# EAGLE design feather-v1 (EAGLE 9.4.0)
COMPANY: ADAFRUIT INDUSTRIES; DRAWN: KTOWN; REV: B

## Sheet 1 of 2
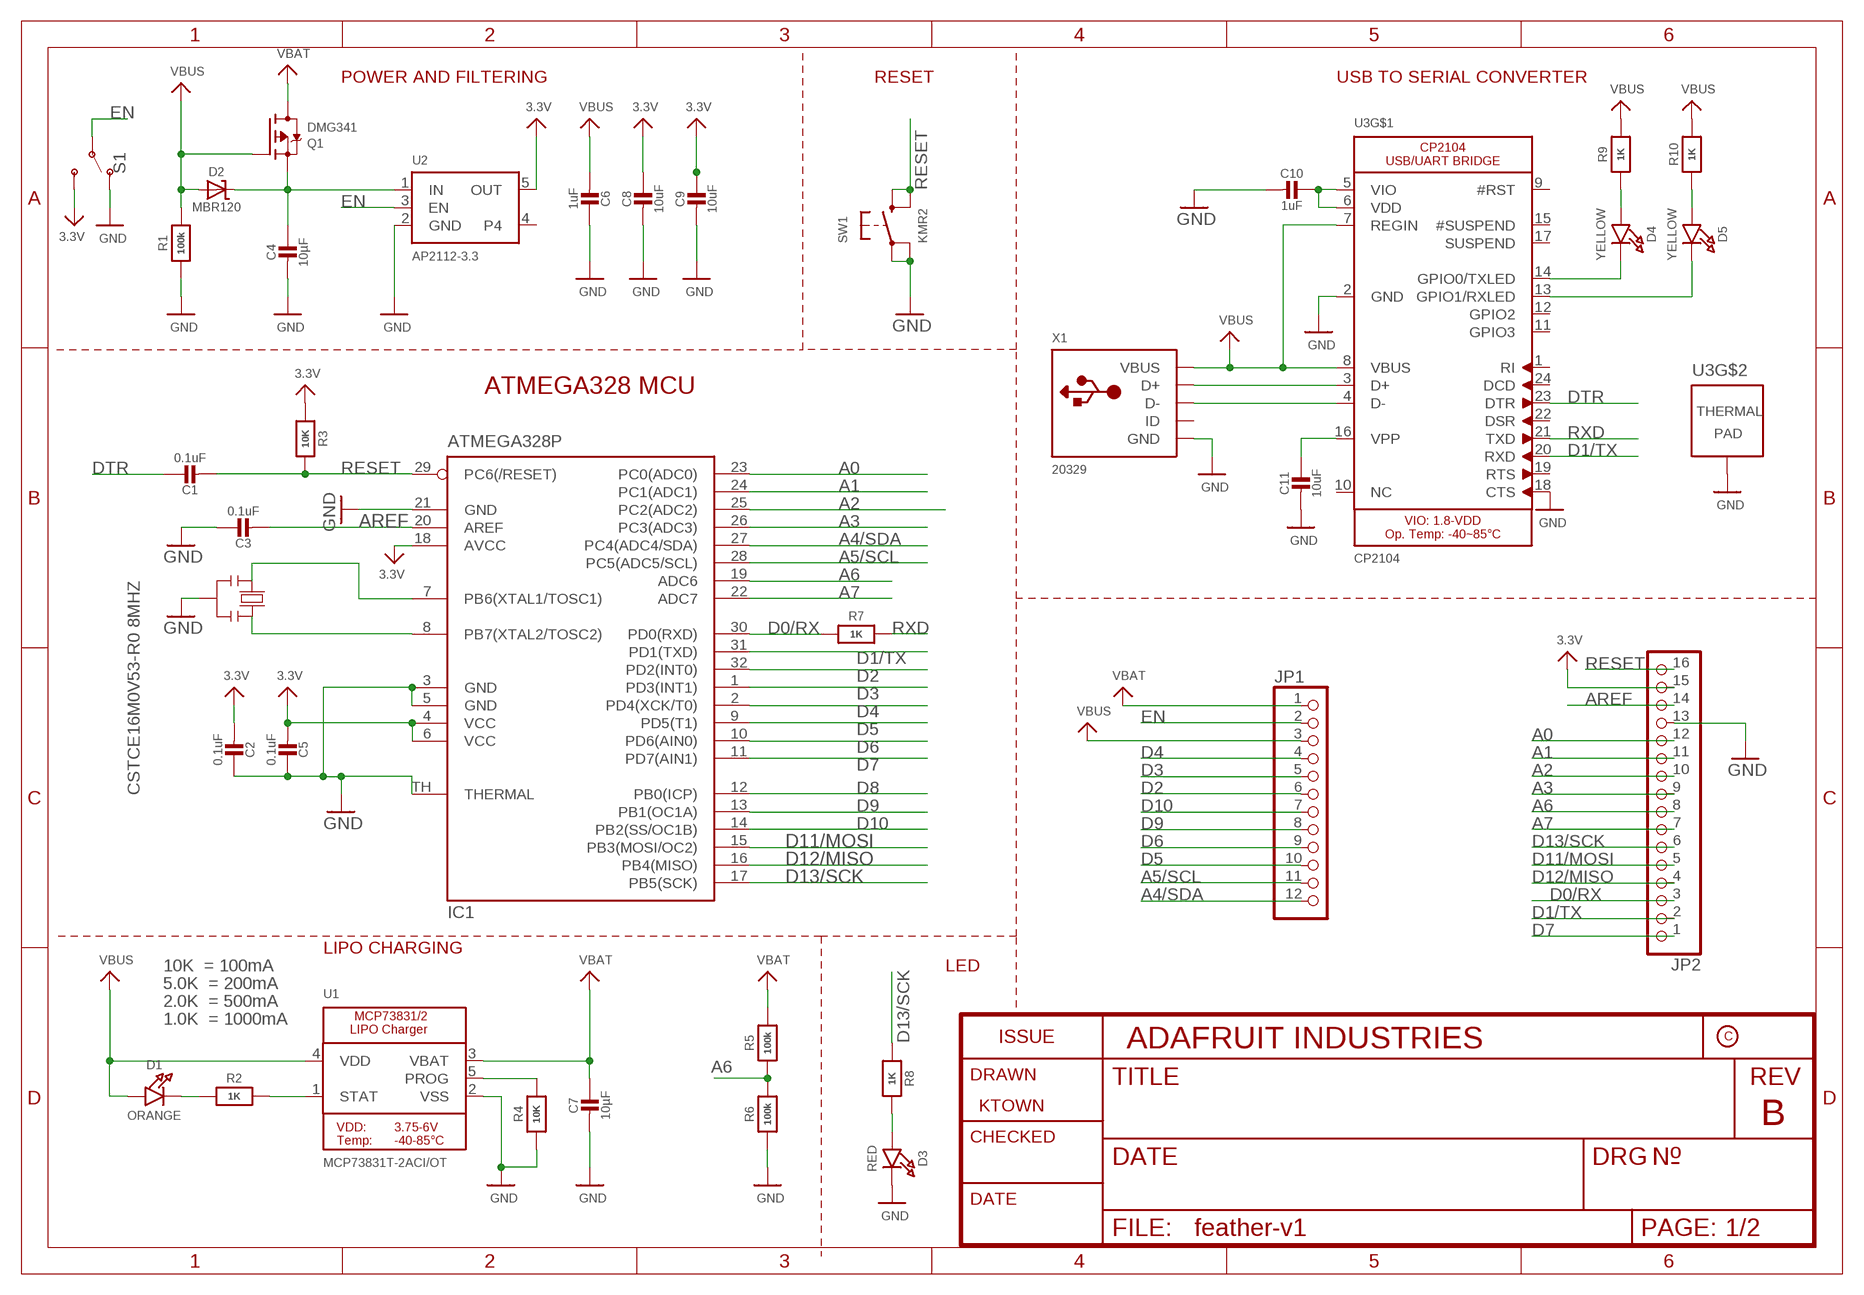
[diagram p0: schematic, sheet 1]

### Parts
C1  0.1uF  CAP_CERAMIC_0603MP  [_0603MP]
C2  0.1uF  CAP_CERAMIC_0603MP  [_0603MP]
C3  0.1uF  CAP_CERAMIC_0603MP  [_0603MP]
C4  10µF  CAP_CERAMIC_0603MP  [_0603MP]
C5  0.1uF  CAP_CERAMIC_0603MP  [_0603MP]
C6  1uF  CAP_CERAMIC_0603MP  [_0603MP]
C7  10µF  CAP_CERAMIC_0603MP  [_0603MP]
C8  10uF  CAP_CERAMIC_0603MP  [_0603MP]
C9  10uF  CAP_CERAMIC_0603MP  [_0603MP]
C10  1uF  CAP_CERAMIC_0603MP  [_0603MP]
C11  10uF  CAP_CERAMIC_0603MP  [_0603MP]
D1  ORANGE  LED0603_NOOUTLINE  [CHIPLED_0603_NOOUTLINE]
D2  MBR120  DIODE-SCHOTTKYSOD-523  [SOD-523]
D3  RED  LED0603_NOOUTLINE  [CHIPLED_0603_NOOUTLINE]
D4  YELLOW  LED0603_NOOUTLINE  [CHIPLED_0603_NOOUTLINE]
D5  YELLOW  LED0603_NOOUTLINE  [CHIPLED_0603_NOOUTLINE]
IC1  ATMEGA328P  MEGA8-MI  [MLF32-TH]
JP1  HEADER-1X12  [1X12_ROUND]
JP2  HEADER-1X16ROUND  [1X16_ROUND]
Q1  DMG341  MOSFET-P  [SOT23-R]
R1  100k  RESISTOR_0603MP  [_0603MP]
R2  1K  RESISTOR_0603MP  [_0603MP]
R3  10K  RESISTOR_0603MP  [_0603MP]
R4  10K  RESISTOR_0603MP  [_0603MP]
R5  100k  RESISTOR_0603MP  [_0603MP]
R6  100k  RESISTOR_0603MP  [_0603MP]
R7  1K  RESISTOR_0603MP  [_0603MP]
R8  1K  RESISTOR_0603MP  [_0603MP]
R9  1K  RESISTOR_0603MP  [_0603MP]
R10  1K  RESISTOR_0603MP  [_0603MP]
S1  SWITCH-SPDT-SMD-RIGHT-ANGLE  [SWITCH_SPST_SMD_A]
SW1  KMR2  SWITCH_TACT_SMT4.6X2.8  [BTN_KMR2_4.6X2.8]
U1  MCP73831T-2ACI/OT  MCP73831/2  [SOT23-5]
U2  AP2112-3.3  VREG_SOT23-5  [SOT23-5]
U3  CP2104  [QFN24_4MM_SMSC]
X1  20329  USB_MICRO_20329_V2  [4UCONN_20329_V2]
Y1  CSTCE16M0V53-R0 8MHZ  RESONATORMU  [RESONATOR]

### Nets
3.3V: C2.2 C5.2 C8.1 C9.1 IC1.4(VCC) IC1.6(VCC) IC1.18(AVCC) JP2.15 R3.2 S1.3(S) U2.5(OUT) ; also sheet 2
A0: IC1.23(PC0(ADC0)) JP2.12 ; also sheet 2
A1: IC1.24(PC1(ADC1)) JP2.11 ; also sheet 2
A2: IC1.25(PC2(ADC2)) JP2.10 ; also sheet 2
A3: IC1.26(PC3(ADC3)) JP2.9 ; also sheet 2
A4/SDA: IC1.27(PC4(ADC4/SDA)) JP1.12
A5/SCL: IC1.28(PC5(ADC5/SCL)) JP1.11
A6: IC1.19(ADC6) JP2.8 R5.1 R6.2
A7: IC1.22(ADC7) JP2.7
AREF [aref]: C3.2 IC1.20(AREF) JP2.14
D0/RX: IC1.30(PD0(RXD)) JP2.3 R7.1
D1/TX: IC1.31(PD1(TXD)) JP2.2 U3.20(RXD)
D2: IC1.32(PD2(INT0)) JP1.6 ; also sheet 2
D3: IC1.1(PD3(INT1)) JP1.5 ; also sheet 2
D4: IC1.2(PD4(XCK/T0)) JP1.4 ; also sheet 2
D5: IC1.9(PD5(T1)) JP1.10
D6: IC1.10(PD6(AIN0)) JP1.9
D7: IC1.11(PD7(AIN1)) JP2.1 ; also sheet 2
D8: IC1.12(PB0(ICP))
D9: IC1.13(PB1(OC1A)) JP1.8
D10: IC1.14(PB2(SS/OC1B)) JP1.7 ; also sheet 2
D11/MOSI: IC1.15(PB3(MOSI/OC2)) JP2.5
D12/MISO: IC1.16(PB4(MISO)) JP2.4
D13/SCK: IC1.17(PB5(SCK)) JP2.6 R8.1
DTR: C1.1 U3.23(DTR)
EN: JP1.2 S1.2(P) U2.3(EN)
GND: C2.1 C3.1 C4.2 C5.1 C6.1 C7.2 C8.2 C9.2 C10.2 C11.2 D3.C IC1.3(GND) IC1.5(GND) IC1.21(GND) IC1.TH(THERMAL) JP2.13 R1.1 R4.1 R6.1 S1.1(O) SW1.A'(P1) SW1.A(P) U1.2(VSS) U2.2(GND) U3.2(GND) U3.18(CTS) U3.THERM(TP) X1.BASE@1(GND) X1.BASE@2(GND) X1.GND X1.SPRT@1(GND) X1.SPRT@2(GND) X1.SPRT@3(GND) X1.SPRT@4(GND) Y1.2 ; also sheet 2
N$1: D1.C R2.1
N$2: U3.3(D+) X1.D+
N$3: R2.2 U1.1(STAT)
N$4: R4.2 U1.5(PROG)
N$5: D3.A R8.2
N$6: U3.4(D-) X1.D-
N$7: C4.1 D2.K(C) Q1.2(S) U2.1(IN)
N$8: D5.A R10.1
N$9: D4.A R9.1
N$10: C10.1 U3.5(VIO) U3.6(VDD)
N$41: C11.1 U3.16(VPP)
RESET: C1.2 IC1.29(PC6(/RESET)) JP2.16 R3.1 SW1.B'(S1) SW1.B(S)
RXD: R7.2 U3.21(TXD)
RXLED: D5.C U3.13(GPIO1/RXLED)
TXLED: D4.C U3.14(GPIO0/TXLED)
VBAT: C7.1 JP1.1 Q1.3(D) R5.2 U1.3(VBAT) ; also sheet 2
VBUS: C6.2 D1.A D2.A JP1.3 Q1.1(G) R1.2 R9.2 R10.2 U1.4(VDD) U3.7(REGIN) U3.8(VBUS) X1.VBUS
XTAL1: IC1.8(PB7(XTAL2/TOSC2)) Y1.3
XTAL2: IC1.7(PB6(XTAL1/TOSC1)) Y1.1
Unconnected: U2.4 U3.1(RI) U3.9(#RST) U3.10(NC) U3.11(GPIO3) U3.12(GPIO2) U3.15(#SUSPEND) U3.17(SUSPEND) U3.19(RTS) U3.22(DSR) U3.24(DCD) X1.ID

### Notes on the sheet
- POWER AND FILTERING | RESET | USB TO SERIAL CONVERTER
- ATMEGA328 MCU
- LIPO CHARGING
- 10K  = 100mA | LED
- 5.0K  = 200mA
- 2.0K  = 500mA
- 1.0K  = 1000mA

## Sheet 2 of 2
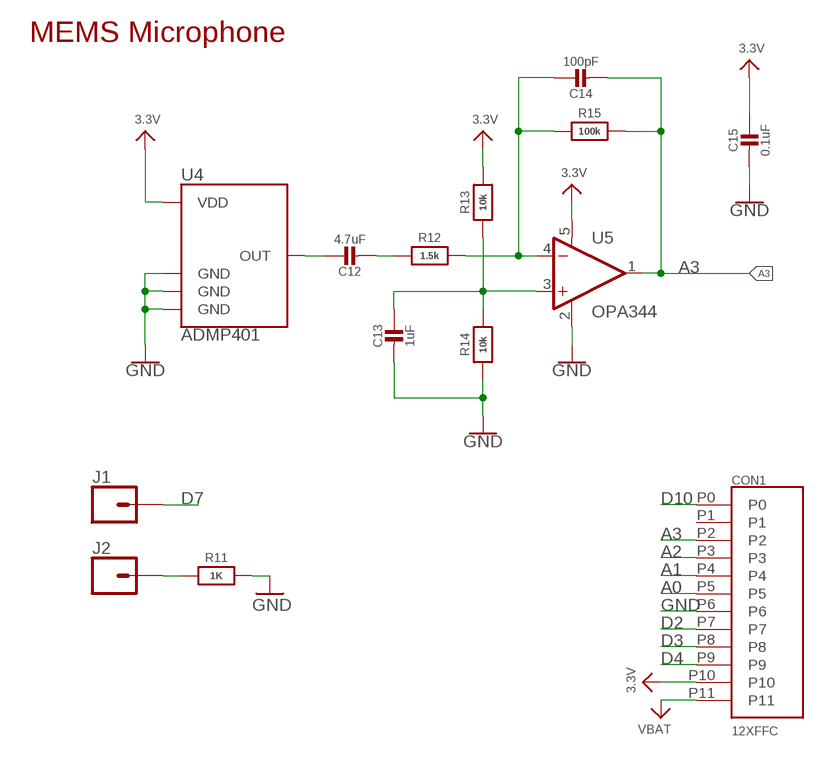
[diagram p1: schematic, sheet 2]

### Parts
C12  4.7uF  CAP_CERAMIC_0603MP  [_0603MP]
C13  1uF  CAP_CERAMIC_0603MP  [_0603MP]
C14  100pF  CAP_CERAMIC_0603MP  [_0603MP]
C15  0.1uF  CAP_CERAMIC_0603MP  [_0603MP]
CON1  12XFFC  [15166-0117]
J1  CONN_01PTH_NO_SILK_YES_STOP  [1X01_NO_SILK]
J2  CONN_01PTH_NO_SILK_YES_STOP  [1X01_NO_SILK]
R11  1K  RESISTOR_0603MP  [_0603MP]
R12  1.5k  RESISTOR_0603MP  [_0603MP]
R13  10k  RESISTOR_0603MP  [_0603MP]
R14  10k  RESISTOR_0603MP  [_0603MP]
R15  100k  RESISTOR_0603MP  [_0603MP]
U4  ADMP401  [ADMP401]
U5  OPA344  [SOT23-5]

### Nets
3.3V: C15.1 CON1.P10 R13.2 U4.5(VDD) U5.5(V+) ; also sheet 1
A0: CON1.P5 ; also sheet 1
A1: CON1.P4 ; also sheet 1
A2: CON1.P3 ; also sheet 1
A3: C14.2 CON1.P2 R15.2 U5.1(OUT) ; also sheet 1
D2: CON1.P7 ; also sheet 1
D3: CON1.P8 ; also sheet 1
D4: CON1.P9 ; also sheet 1
D7: J1.1 ; also sheet 1
D10: CON1.P0 ; also sheet 1
GND: C13.2 C15.2 CON1.P6 R11.2 R14.1 U4.2(GND) U4.4(GND) U4.6(GND) U5.2(V-) ; also sheet 1
N$12: J2.1 R11.1
N$16: C12.1 U4.1(OUT)
N$17: C14.1 R12.2 R15.1 U5.4(-IN)
N$29: C12.2 R12.1
N$30: C13.1 R13.1 R14.2 U5.3(+IN)
VBAT: CON1.P11 ; also sheet 1
Unconnected: CON1.P1

### Notes on the sheet
- MEMS Microphone

## Library data of the parts
C1-C15 = NU-Smarticle v2:CAP_CERAMIC: Ceramic Capacitors For new designs, use the packages preceded by an '_' character since they are more reliable: The following footprints should be used on most boards: _0402 - Standard footprint for regular board layouts _0603 - Standard footprint for regular board layouts _0805 - Standard footprint for regular board layouts _1206 - Standard footprint for regular board layouts For extremely tight-pitch boards where space is at a premium, the following 'micro-pitch' footprints can be used (smaller pads, no silkscreen outline, etc.): _0402MP - Micro-pitch footprint for very dense/compact boards _0603MP - Micro-pitch footprint for very dense/compact boards _0805MP - Micro-pitch footprint for very dense/compact boards _1206MP - Micro-pitch footprint for very dense/compact boards
CON1 = NU-Smarticle v2:12XFFC
D1 D3-D5 = NU-Smarticle v2:LED: LED 0603 - 0603 Surface Mount Package 2mA: Green LED - Low Power (3.9mcd, 2ma, 1.7Vf) - Digikey: 475-2709-2-ND Orange LED - Low Power (9.8mcd, 2ma, 1.8Vf) - Digikey: 475-1194-2-ND Red LED - Low Power (5mcd, 2ma, 1.8Vf) - Digikey: 475-1195-2-ND Yellow LED - Low Power (7mcd, 2ma, 1.8Vf) - Digikey: 475-1196-2-ND 5mA: Blue LED - Low Power (17mcd, 5ma, 2.9Vf) - Digikey: LNJ937W8CRACT-ND 0805 - 0805 Surface Mount Package 2mA: Red LED (8.8mcd, 2mA, 1.8Vf, Clear) - Low Power [Digikey: 475-2510-1-ND] Green LED (5mcd, 2mA, 1.8Vf, Clear) - Low Power [Digikey: 475-2730-1-ND] Yellow LED (11.3mcd, 2mA, 1.8Vf, Clear) - Low Power [Digikey: 475-2555-1-ND] 20mA: Red LED (104mcd, 20mA, Diffused) - LS R976 [Digikey: 475-1278-6-ND] Red LED (12mcd, 20mA, 2.0Vf, Clear) - APT2012EC [Digikey: 754-1128-1-ND] Green LED (15mcd, 20mA, 2.2Vf, Clear) - APT2012GC [Digikey: 754-1131-1-ND] Orange LED (160mcd, 20mA, 2.1Vf, Clear) - APT2012SECK [Digikey: 754-1130-1-ND] 1206 - 1206 Surface Mount Package Green LED (26mcd, 20mA, Diffused) - LG N971 [Digikey: 475-1407-6-ND] Red LED (15mcd, 20mA, Diffused) - LH N974 [Digikey: 475-1416-6-ND] Cree - Cree High-Power Surface Mount LEDs XPEBWT-L1-0000-00D50 - White 111lm 350mA 2.9Vf 6200K 110° XTEAWT-00-0000-00000LEE3 - White 114lm 350mA 2.85Vf 5000K 115° Everlight - Everlight 45-21 Series Surface Mount LEDs 45-21/QK2C-B2832AC2CB2/2T - Warm White 2000mcd 20mA 3.25Vf 3050K 120° 45-21/LK2C-B38452C4CB2/2T - Nuetral White 2000mcd 20mA 3.25Vf 4150K 120° 45-21/LK2C-B50634C6CB2/2T - Cold White 2200mcd 20mA 3.25Vf 5650K 120° PLCC2 Reverse Mount LS T77K-J1L2-1-0-2-R18-Z - Red 11.25mcd 2mA 1.8Vf 630nm 120° LO T77K-L1M2-24-Z - Orange 19.6mcd 2mA 1.8Vf 606nm 120° LY T77K-K2M1-26-Z - Yellow 15.7mcd 2mA 1.8Vf 587nm 120°
D2 = NU-Smarticle v2:DIODE-SCHOTTKY
IC1 = NU-Smarticle v2:MEGA8-MI: MICROCONTROLLER 8 Kbytes FLASH, 1 kbytes SRAM, 512 bytes EEPROM, USART, 6-channel 10 bit ADC, 2-channel 8 bit ADC Pin compatible with Atmega48, ATMega88, ATMega168 Source: avr.lbr; MPN: ATMEGA88PA-MU; OC_FARNELL: 1715491; OC_NEWARK: 15R0272
J1 J2 = NU-Smarticle v2:CONN_01: Single connection point. Often used as Generic Header-pin footprint for 0.1 inch spaced/style header connections On any of the 0.1 inch spaced packages, you can populate with these: Break Away Headers - Straight (PRT-00116) Break Away Male Headers - Right Angle (PRT-00553) Female Headers (PRT-00115) Break Away Headers - Machine Pin (PRT-00117) Break Away Female Headers - Swiss Machine Pin (PRT-00743) This device is also useful as a general connection point to wire up your design to another part of your project. Our various solder wires solder well into these plated through hole pads. Hook-Up Wire - Assortment (Stranded, 22 AWG) (PRT-11375) Hook-Up Wire - Assortment (Solid Core, 22 AWG) (PRT-11367) View the entire wire category on our website here Special notes: SMTSO-256-ET is a "flush mount" nut for a 4-40 screw. We mostly use this on specialty testbeds; it is a nice way to connect hardware to your PCB at an adjustable hieght. Also note, the SNAP packages are for using a snappable style connector. We sell a baggie of snaps and they are also used on two LilyPad designs: Snap Assortment - 30 pack (male and female) (DEV-11347) LilyPad Arduino SimpleSnap (DEV-10941) LilyPad SimpleSnap Protoboard (DEV-10940)
JP1 = NU-Smarticle v2:HEADER-1X12
JP2 = NU-Smarticle v2:HEADER-1X16: PIN HEADER
Q1 = NU-Smarticle v2:MOSFET-P: P-Channel Mosfet LEGEND VDS: Voltage Drain-Source ID: Drain Current RDS(ON): Drain-Source On-State Resistance VGS(TH): Gate-Source Threshold Voltage CISS: Drain-Source Input Capacitance SOT-23 Name VDS ID RDS(ON) VGS(TH) CISS Order Number IRLML5103 30V 760mA 600 mOhm -- 75pF @ 25V Digikey: IRLML5103PBFCT-ND IRLML6401 12V 4.3A 50 mOhm 950mV @ 250µA 830pF @ 10V Digikey: IRLML6401PBFTR-ND NTR0202PL 20V 400mA 800 mOhm 2.3V @ 250uA 70pF @ 5V Digikey: NTR0202PLT1GOSTR-ND NTR4101PT1G 20V 1.8A 85 mOhm 1.2V @ 250uA 675pF @ 10V Digikey: NTR4101PT1GOSCT-ND DMP2004K 20V 600mA 900 mOhm 1V @ 250uA 175pF @ 16V Digikey: DMP2004KDICT-ND PMV65XP 20V 3.9A 76 mOhm 950mV @ 1mA 725pF @ 20V Digikey: 568-2358-2-ND TO-252 Name VDS ID RDS(ON) VGS(TH) CISS Order Number AOD417 30V 25A 34 mOhm 3V @ 250µA 920pF @ 15V Digikey: 785-1106-2-ND PowerPak Name VDS ID RDS(ON) VGS(TH) CISS Order Number AON7401 30V 12A 14 mOhm 3V @ 250µA 2600pF @ 15V Digikey: 785-1302-1-ND
R1-R15 = NU-Smarticle v2:RESISTOR: Resistors For new designs, use the packages preceded by an '_' character since they are more reliable: The following footprints should be used on most boards: _0402 - Standard footprint for regular board layouts _0603 - Standard footprint for regular board layouts _0805 - Standard footprint for regular board layouts _1206 - Standard footprint for regular board layouts For extremely tight-pitch boards where space is at a premium, the following 'micro-pitch' footprints can be used (smaller pads, no silkscreen outline, etc.): _0402MP - Micro-pitch footprint for very dense/compact boards _0603MP - Micro-pitch footprint for very dense/compact boards _0805MP - Micro-pitch footprint for very dense/compact boards _1206MP - Micro-pitch footprint for very dense/compact boards
S1 = NU-Smarticle v2:SWITCH-SPDT: Single Pole, Double Throw (SPDT) Switch Single-pole, double-throw (SPDT) switch. Variant Overview SMD-AYZ0202 Surface Mount DPDT Switch (COM-00597) Used on e.g. LilyPad Arduino USB - ATmega32U4 Board PTH-11.6X4.0MM SPDT Mini Power Switch (COM-00102) Used on e.g. SparkFun Simon Says - Through-Hole Soldering Kit (KIT-10547) PTH-11.6X4.0MM-KIT KIT version of SPDT Mini Power Switch - Simplifies soldering by removing tStop of switch pins - only one side can be soldered. PTH-11.6X4.0MM-LOCK LOCK version of SPDT Mini Power Switch - Offset pins hold switch in place for easier soldering. SMD-RIGHT-ANGLE Surface Mount Right Angle Switch (COM-10860) Used on e.g. SparkFun ESP8266 Thing; PROD_ID: SWCH-10651; SF_SKU: COM-10860
SW1 = NU-Smarticle v2:SWITCH_TACT_SMT: SMT Tact Switches 6x6mm - Digikey: P12940SCT-ND KMR2 (4.6x2.8mm) - Digikey: 401-1426-1-ND EVQ-PQHB55 - Light Touch, 160GF (4.5x4.5mm) - Digikey: P8090SCT-ND KMT0 - KMT021 NGJ LHS (etc.) IP68/Waterproof - Digikey: CKN10289CT-ND
U1 = NU-Smarticle v2:MCP73831/2: MCP73831/2 LIPO Charger VDD: 3.75 - 6V Temp -40 - 85°C Programmable Charge Rate: 15-500mA NOTE: STAT is a tri-state logic output on the MCP73831 and an open-drain output on the MCP73832. SOT23-5 with 4.2V output and tri-state logic on STAT = MCP73831T-2ACI/OT
U2 = NU-Smarticle v2:VREG_SOT23-5: SOT23-5 Fixed Voltage Regulators Part Current Out V Out V In V Dropout θJA (°C/W) TJ (°C) Digikey Part No. ADP121 150mA 3.3V 3.4-5.5V 0.09V @ 150mA -- -- ADP121-AUJZ33R7CT-ND ADP121 150mA 3.0V 3.1-5.5V 0.09V @ 150mA -- -- ADP121-AUJZ30R7CT-ND ADP122 300mA 3.3V 3.4-5.5V 0.085V @ 300mA -- -- ADP122AUJZ-3.3-R7CT-ND ADP1712 300mA 3.3V 3.5-5.5V 0.17V @ 300mA -- -- ADP1712AUJZ-3.3-R7TR-ND AP7311 (Low Cost) 150mA 3.3V 3.5-6V 0.15V @ 150mA -- -- AP7311-33WG-7DICT-ND LD39015M18R 150mA 1.8V 1.9V-5.5V 0.08V @ 100mA -- -- 497-6977-1-ND LP2985A-33DBVR 150mA 3.3V 3.3-16V 0.28V @ 150mA 206 150 296-18479-1-ND MCP1824T-3302E/OT 300mA 3.3V 3.5V-6V 0.2V @ 300mA -- -- MCP1824T-3302E/OTCT-ND MIC5205-2.5YM5 TR 150mA 2.5V 2.7-16V 0.165V @ 150mA -- -- 576-1257-2-ND MIC5205-3.0YM5 TR 150mA 3.0V 3.2V-16V 0.165V @ 150mA -- -- 576-1258-2-ND MIC5205-3.3YM5 TR 150mA 3.3V 3.5V-16V 0.165V @ 150mA -- -- 576-1259-2-ND TPS780330220 150mA 3.3V+2.2V 3.6-5.5V 250mV Max -- -- 296-23332-1-ND TDA3663/N1,135 100mA 3.3V 3.5-45V 0.18V @ 50mA -- -- 568-5343-1-ND Max operating temp can be calculated using θJA, TJ (max junction temperature), and power in watts. Set the "Maximum Ambient Temperature" until it reaches TJ ("Max Junction Temperature"), which is the absolute limit for safe use of the regulator: Heat Sink Temperature Calculator For example, With 12V source into a 3.3V LP2985 and a 30mA load, we are dissipating (12V-3.3V) * 0.03A = 0.261W. With a θJA of 206 °C/W, a TJ of 150°C, and 261mW we can safely use the chip without a heat sink up to 75°C (=147.1°C Junction Temperature).
U3 = NU-Smarticle v2:CP2104: CP2104 - USB to UART Bridge VDD Output: 3.45V
U4 = NU-Smarticle v2:ADMP401: MEMS Microphone
U5 = NU-Smarticle v2:OPA344
X1 = NU-Smarticle v2:USB: USB Connectors USBMINIB - Surface Mount Female Mini-B USB Connector 4UConnector: 06564
Y1 = SmartPrj:RESONATOR

## Net classes
1 power: width 0.305 mm, drill 0.483 mm, clearance 0.203 mm
2 gnd: width 0.305 mm, drill 0.483 mm, clearance 0.203 mm
3 usbvcc: width 0.305 mm, drill 0.483 mm, clearance 0.203 mm
4 aref: width 0.254 mm, drill 0.483 mm, clearance 0.203 mm

## Board
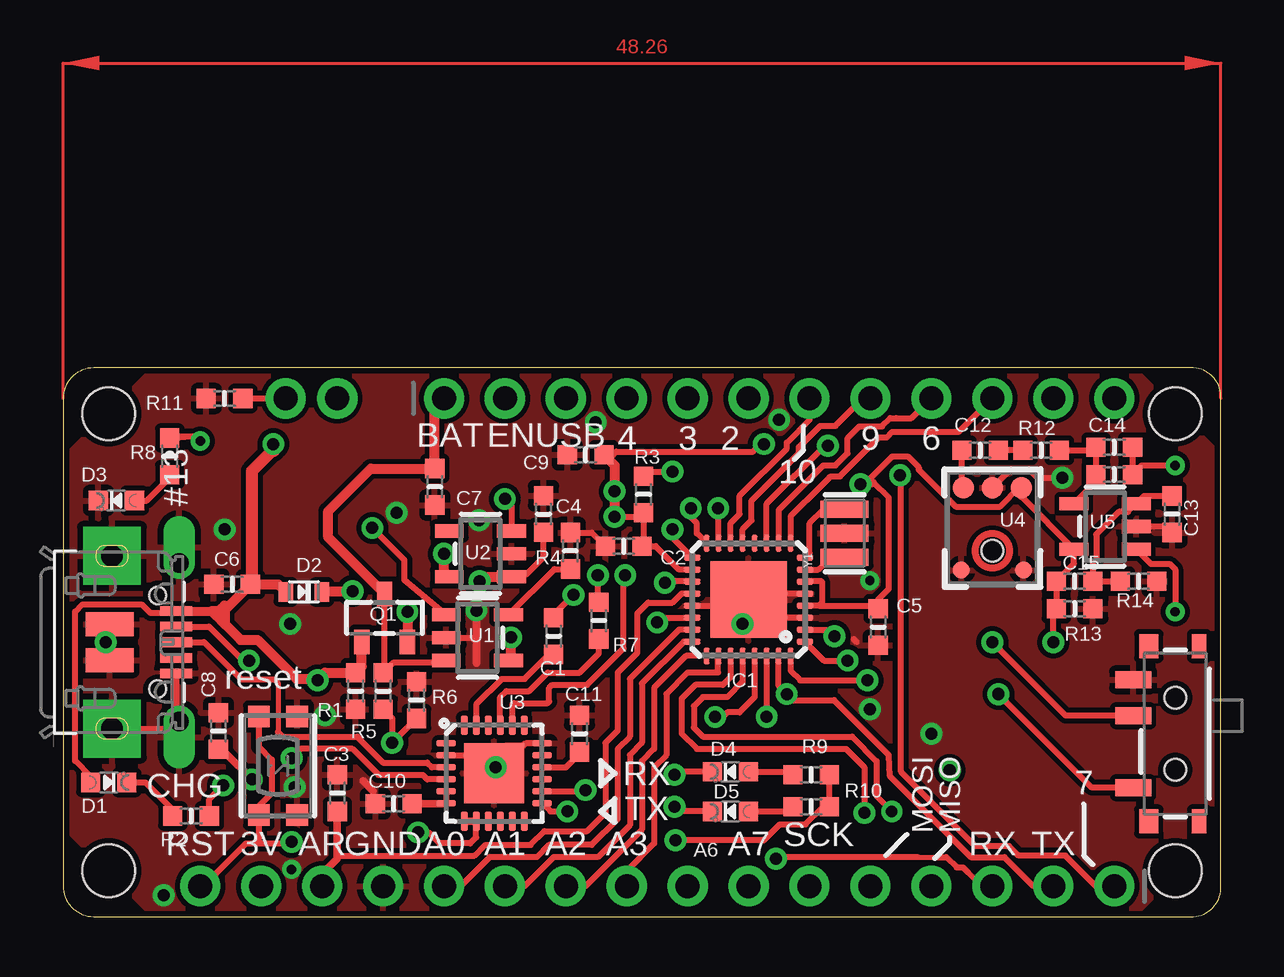
[diagram p2: board, top side]
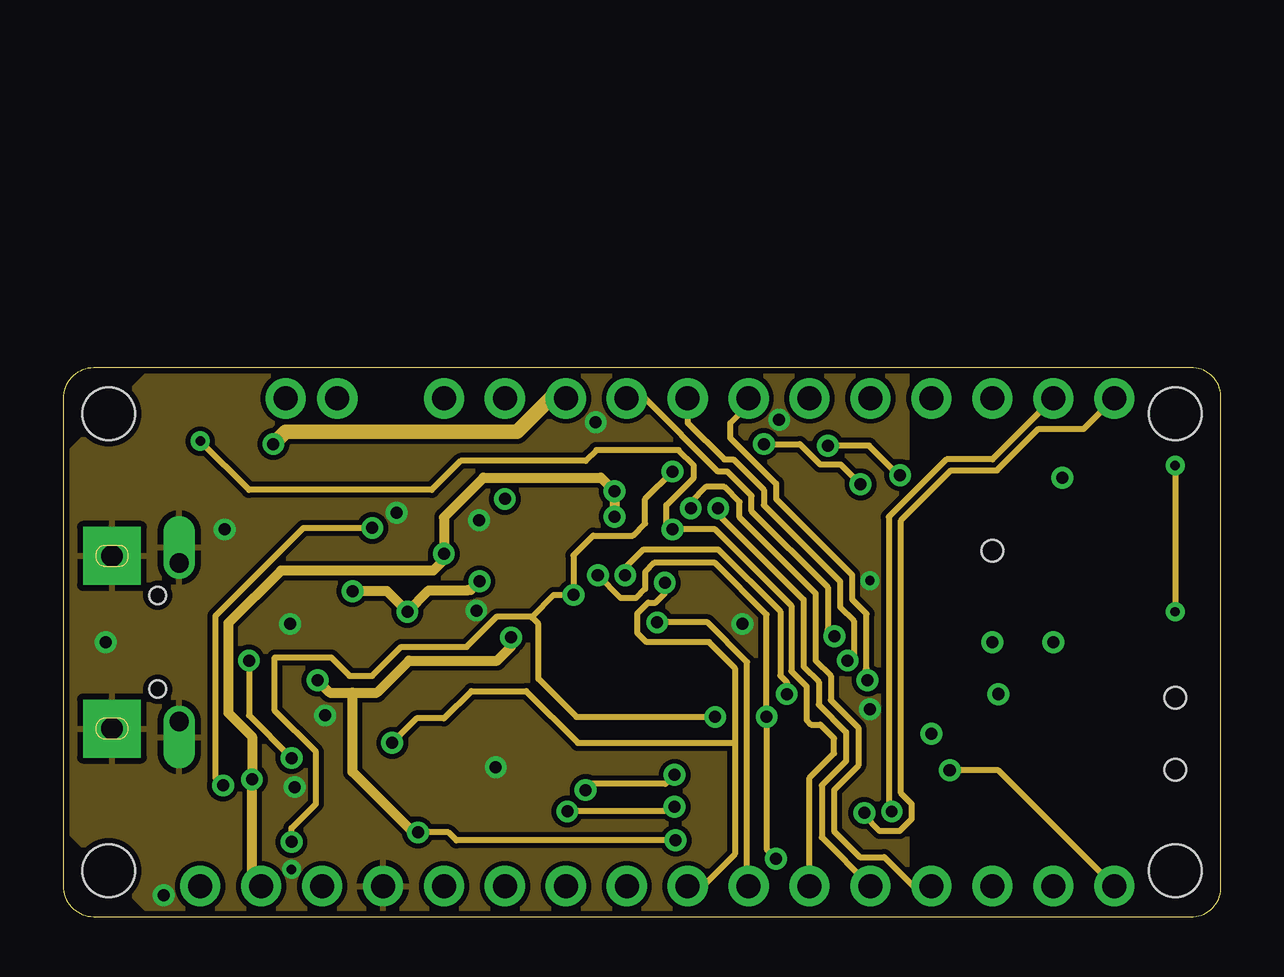
[diagram p3: board, inner layer Route2]
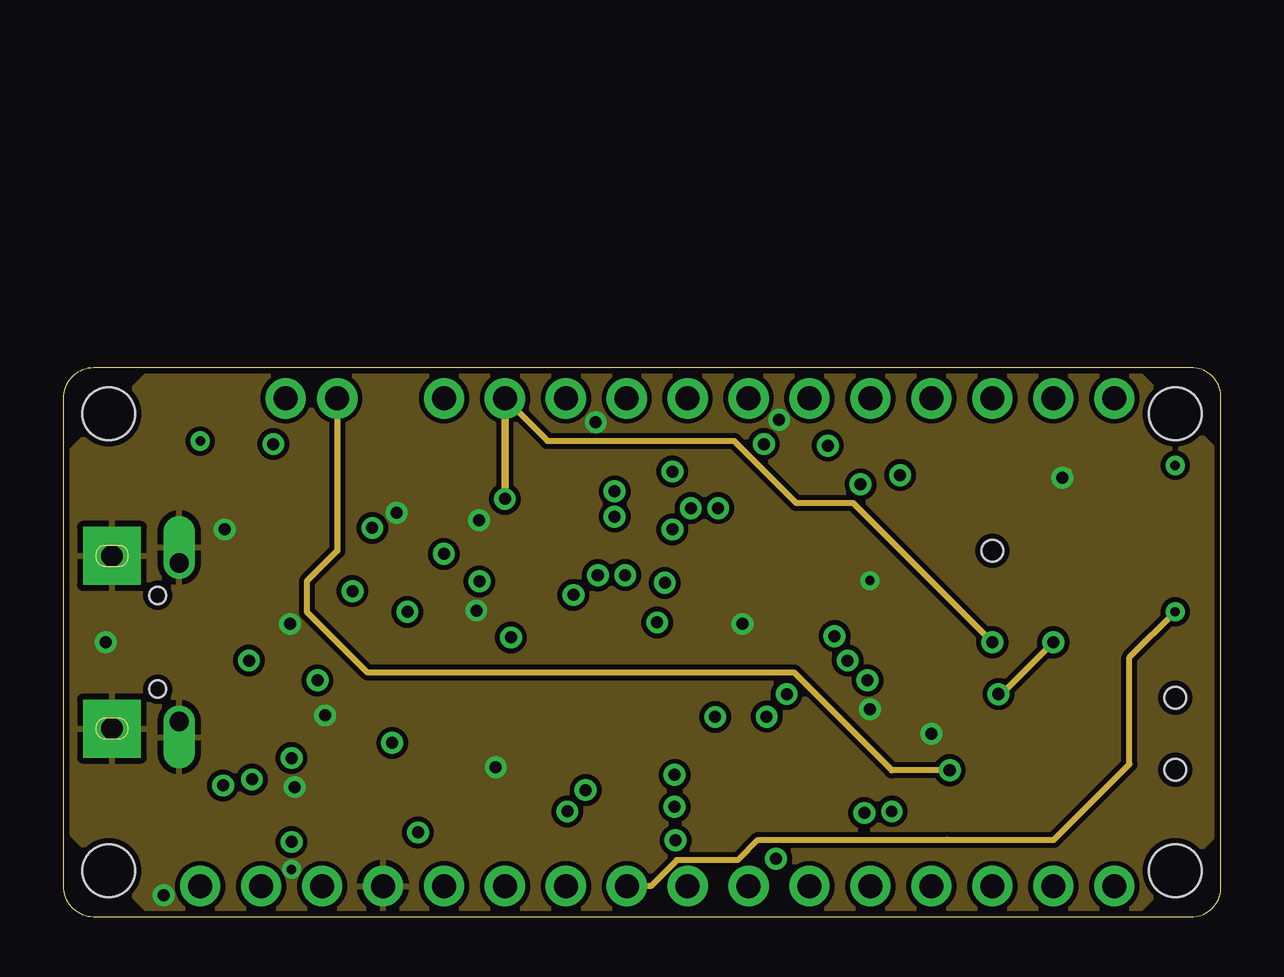
[diagram p4: board, inner layer Route15]
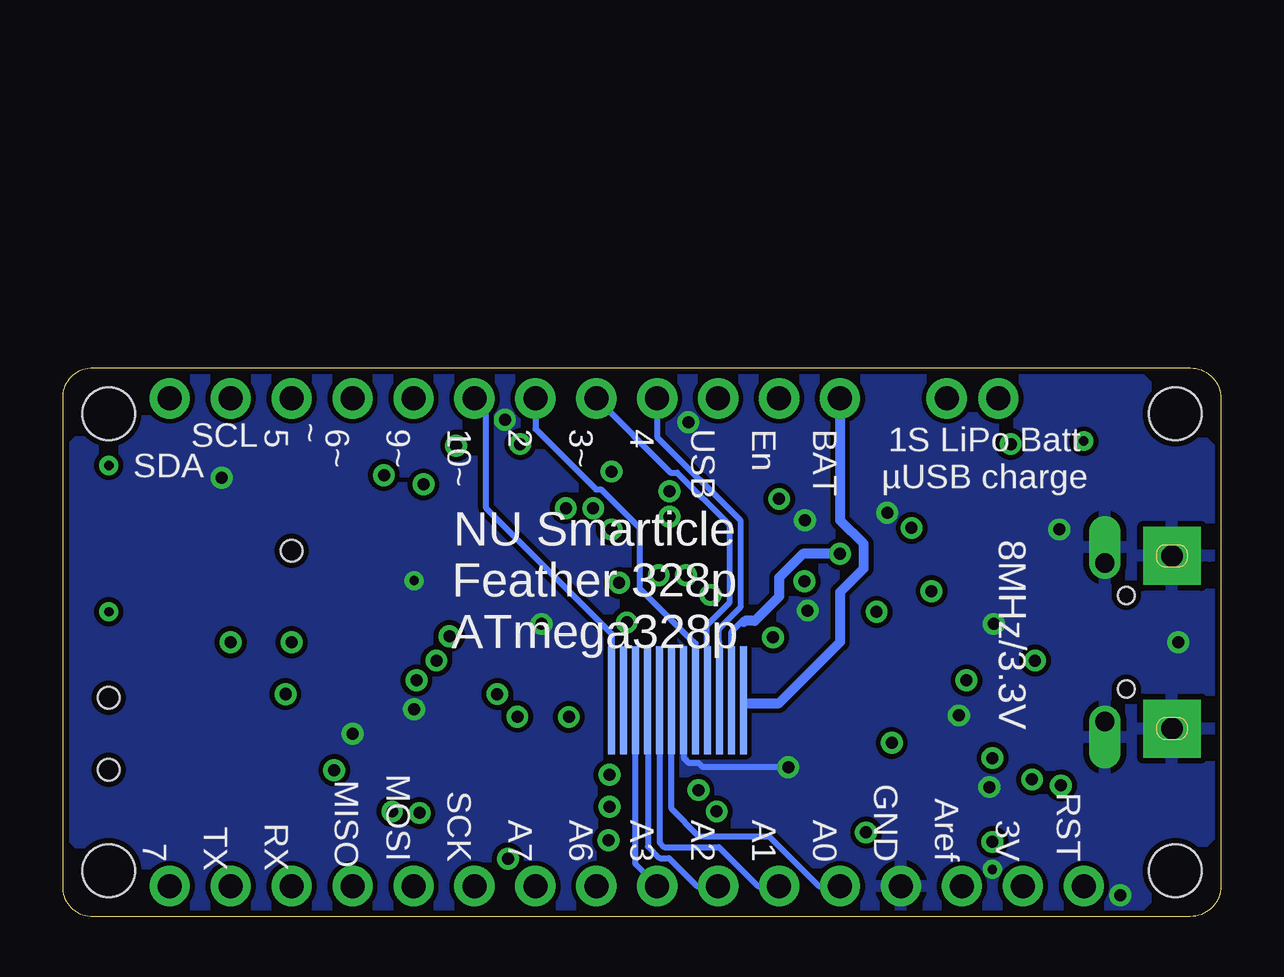
[diagram p5: board, bottom side, seen from below]

Size 48.26 x 22.86 mm. Coordinates in mm from the lower left corner, seen from the top.
Outline: 0,21.59 0,1.27 arc90 1.27,0 47.12,0 arc90 48.26,1.27 48.26,21.59 arc90 47.12,22.86 1.27,22.86 arc90 0,21.59
Copper layers (1+2*15+16): Top 0.035mm / dielectric 1.5mm / Route2 0.035mm / dielectric 0.15mm / Route15 0.035mm / dielectric 0.2mm / Bottom 0.035mm
Design rules "adafruit *": minimum track width 8mil, minimum drill 15.5mil, track to track 8mil, track to pad 8mil, pad to pad 8mil, via to via 8mil, smd to smd 8mil, copper to edge 10mil, drill to drill 8mil, minimum pad ring 10mil, minimum via ring 8mil, stop-mask expansion 2mil, vias tented up to drill 20mil, thermal gap 10mil
Holes 2.2 mm at 46.35,1.91 46.35,20.95 1.91,1.91 1.91,20.95

### Footprints (pad centres in the part's own frame; a part is rotated, then mirrored left to right if it is on the bottom)
_0603MP = smd 0.8 x 0.8: 1 -0.762,0; 2 0.762,0
15166-0117 = smd 0.279 x 4.5: P0 0,2; P1 0.5,2; P2 1,2; P3 1.5,2; P4 2,2; P5 2.5,2; P6 3,2; P7 3.5,2; P8 4,2; P9 4.5,2; P10 5,2; P11 5.5,2
CHIPLED_0603_NOOUTLINE = smd 0.8 x 0.8: A 0,-0.75; C 0,0.75
SOD-523 = smd 0.8 x 0.6: A 0,-0.75; K 0,0.75
MLF32-TH = smd 0.7 x 0.25: 1 -2.35,1.75; 2 -2.35,1.25; 3 -2.35,0.75; 4 -2.35,0.25; 5 -2.35,-0.25; 6 -2.35,-0.75; 7 -2.35,-1.25; 8 -2.35,-1.75; 17 2.35,-1.75; 18 2.35,-1.25; 19 2.35,-0.75; 20 2.35,-0.25; 21 2.35,0.25; 22 2.35,0.75; 23 2.35,1.25; 24 2.35,1.75 | smd 0.25 x 0.7: 9 -1.75,-2.35; 10 -1.25,-2.35; 11 -0.75,-2.35; 12 -0.25,-2.35; 13 0.25,-2.35; 14 0.75,-2.35; 15 1.25,-2.35; 16 1.75,-2.35; 25 1.75,2.35; 26 1.25,2.35; 27 0.75,2.35; 28 0.25,2.35; 29 -0.25,2.35; 30 -0.75,2.35; 31 -1.25,2.35; 32 -1.75,2.35 | smd 3.2 x 3.2: TH 0,0
1X01_NO_SILK = drill 1 pad 1.676: 1 0,0
1X12_ROUND = drill 1 pad 1.676: 1 -13.97,0; 2 -11.43,0; 3 -8.89,0; 4 -6.35,0; 5 -3.81,0; 6 -1.27,0; 7 1.27,0; 8 3.81,0; 9 6.35,0; 10 8.89,0; 11 11.43,0; 12 13.97,0
1X16_ROUND = drill 1 pad 1.676: 1 -19.05,0; 2 -16.51,0; 3 -13.97,0; 4 -11.43,0; 5 -8.89,0; 6 -6.35,0; 7 -3.81,0; 8 -1.27,0; 9 1.27,0; 10 3.81,0; 11 6.35,0; 12 8.89,0; 13 11.43,0; 14 13.97,0; 15 16.51,0; 16 19.05,0
SOT23-R = smd 0.635 x 1.016: 1 -0.95,-1; 2 0.95,-1; 3 0,1
SWITCH_SPST_SMD_A = smd 0.7 x 1.5: 1 -2.25,-1.75; 2 -0.75,-1.75; 3 2.25,-1.75 | smd 1 x 0.6: GND1 -3.65,1; GND3 3.65,1 | smd 1 x 0.8: GND2 -3.65,-1.1; GND4 3.65,-1.1 | hole 0.9: -1.5,0; 1.5,0
BTN_KMR2_4.6X2.8 = smd 0.9 x 0.9: A 2.05,0.8; A' -2.05,0.8; B 2.05,-0.8; B' -2.05,-0.8
SOT23-5 = smd 0.55 x 1.2: 1 -0.95,-1.3; 2 0,-1.3; 3 0.95,-1.3; 4 0.95,1.3; 5 -0.95,1.3
QFN24_4MM_SMSC = smd 0.8 x 0.28: 1 -2,1.25; 2 -2,0.75; 3 -2,0.25; 4 -2,-0.25; 5 -2,-0.75; 6 -2,-1.25; 13 2,-1.25; 14 2,-0.75; 15 2,-0.25; 16 2,0.25; 17 2,0.75; 18 2,1.25 | smd 0.28 x 0.8: 7 -1.25,-2; 8 -0.75,-2; 9 -0.25,-2; 10 0.25,-2; 11 0.75,-2; 12 1.25,-2; 19 1.25,2; 20 0.75,2; 21 0.25,2; 22 -0.25,2; 23 -0.75,2; 24 -1.25,2 | smd 2.5 x 2.5: THERM 0,0
ADMP401 = smd 0.9 x 0.9: 1 -1.2,2.62; 5 1.2,2.62; 6 0,2.62 | smd 0.7 x 0.7: 2 1.3,-0.8; 4 -1.3,-0.8 | hole 0.9: 0,0
4UCONN_20329_V2 = smd 1 x 2: BASE@1 -0.75,-2; BASE@2 0.75,-2 | smd 0.4 x 1.35: D+ 0,0.775; D- -0.65,0.775; GND 1.3,0.775; ID 0.65,0.775; VBUS -1.3,0.775 | drill 0.8 pad 1.143 offset: SPRT@1 -3.3,0.9; SPRT@2 3.3,0.9 | drill 0.9 pad 2.413 square: SPRT@3 -3.6,-1.9; SPRT@4 3.6,-1.9 | hole 0.7: -1.95,0; 1.95,0
RESONATOR = smd 0.7 x 2: 1 -1,0; 2 0,0; 3 1,0

### Placement (x,y rotation side)
C1  20.45,11.68 90 top
C2  23.37,15.43 0 top
C3  11.43,5.14 270 top
C4  20.03,16.77 90 top
C5  33.97,12.06 90 top
C6  7.05,13.84 0 top
C7  15.49,17.91 270 top
C8  6.48,7.73 90 top
C9  21.78,19.24 180 top
C10  13.78,4.7 180 top
C11  21.53,7.62 90 top
C12  38.23,19.43 0 top
C13  46.23,16.76 270 top
C14  43.81,19.56 0 top
C15  42.16,12.83 0 top
CON1  25.4,7.02 0 bottom
D1  1.91,5.59 270 top
D2  10.03,13.53 270 top
D3  2.22,17.34 90 top
D4  27.81,6.03 90 top
D5  27.81,4.38 90 top
IC1  28.57,13.21 180 top
J1  11.43,21.59 0 top
J2  9.27,21.59 0 top
JP1  29.84,21.59 0 top
JP2  24.77,1.27 180 top
Q1  13.4,12.45 0 top
R1  12.19,9.4 90 top
R2  5.33,4.19 0 top
R3  24.19,17.59 270 top
R4  21.15,15.24 270 top
R5  13.34,9.4 90 top
R6  14.73,9.02 270 top
R7  22.33,12.33 270 top
R8  4.45,19.18 270 top
R9  31.18,5.91 0 top
R10  31.18,4.57 0 top
R11  6.73,21.59 180 top
R12  40.77,19.43 0 top
R13  42.16,13.97 180 top
R14  44.83,13.97 180 top
R15  43.81,18.41 0 top
S1  46.35,7.62 270 top
SW1  8.95,6.29 270 top
U1  17.27,11.62 270 top
U2  17.4,15.11 90 top
U3  17.97,5.97 0 top
U4  38.73,15.24 0 top
U5  43.43,16.26 90 top
X1  3.94,11.43 270 top
Y1  32.58,15.98 90 top

### Tracks (layer width: path | path; a pad name or v marks a point on that pad's centre or on a via)
3.3V  (via drill 0.5, 0.51)
  Top 0.254: IC1.18 25.67,14.46 24.7,15.43 24.51,15.43 | IC1.6 31.62,13.97 31.62,13.08 31.5,12.95 | 31.5,12.95 IC1.4 | v29.21,19.68 29.08,19.68 28.77,19.37 23.05,19.37 22.92,19.24 C9.1 | R3.2 24.19,16.51 | v22.99,16.66 24.04,16.66 24.19,16.51 | 31.5,12.95 33.85,12.95 C5.2 33.97,13.21 34.42,13.65 34.42,17.46 33.78,18.1 33.69,18.01 v33.24,18.01 33.4,18.01 34.56,19.17 35.21,19.17 35.67,18.71 35.67,18.62 37.21,17.08 39.06,17.08 39.84,17.86 U4.5 | 24.19,16.51 24.19,15.75 24.51,15.43 | C2.2 24.51,15.43 | 39.94,17.5 U5.5 42.13,14.7 R13.2 C15.1 41.27,12.7 v41.27,11.43 | S1.3 42.89,5.37 v38.99,9.27 | C8.1 6.8,6.78
  Top 0.305: 6.8,6.78 v7.87,5.71 | U4.5 39.94,17.5
  Top 0.406: v15.88,15.11 15.88,14.39 U2.5 | v22.99,16.66 v22.99,17.72 22.99,18.8 C9.1
  Route2 0.254: v29.21,19.68 30.71,19.68 31.55,18.84 32.41,18.84 v33.24,18.01
  Route2 0.406: v22.99,16.66 v22.99,17.72 22.42,18.29 17.53,18.29 15.88,16.64 v15.88,15.11 15.88,14.86 15.43,14.41 9.08,14.41 6.89,12.22 6.89,8.49 7.87,7.5 v7.87,5.71 7.87,1.65 JP2.15
  Route15 0.254: v38.99,9.27 39.12,9.27 v41.27,11.43
  Bottom 0.254: CON1.P10 20.4,11.87 19.95,12.32 19.84,12.32
  Bottom 0.406: v15.88,15.11 17.43,15.11 18.41,14.13 18.41,13.34 19.43,12.32 19.84,12.32 19.89,12.27
A0
  Top 0.254: IC1.23 25.67,11.96 23.62,9.91 23.62,7.49 23.11,6.99 23.11,4.06 22.04,2.98 20.26,2.98 19.75,2.48 17.78,2.48 16.57,1.27 JP2.12
  Bottom 0.254: JP2.12 16.76,1.27 18.84,3.35 21.77,3.35 22.9,4.49 CON1.P5
A1
  Top 0.254: IC1.24 25.87,11.46 24.13,9.72 24.13,7.24 23.62,6.73 23.62,3.81 22.29,2.48 20.45,2.48 19.24,1.27 JP2.11
  Bottom 0.254: JP2.11 19.3,1.27 20.93,2.9 23.2,2.9 23.4,3.09 CON1.P4
A2
  Top 0.254: IC1.25 25.97,10.86 24.64,9.53 24.64,6.99 24.13,6.48 24.13,3.62 21.78,1.27 JP2.10
  Bottom 0.254: JP2.10 21.84,1.27 23.01,2.44 23.39,2.44 23.88,2.92 23.88,8.96 CON1.P3
A3  (via drill 0.39)
  Top 0.254: IC1.26 27.3,10.84 27.3,10.16 26.04,10.16 25.15,9.27 25.15,6.73 24.64,6.22 24.64,3.05 23.5,1.91 JP2.9 | U5.1 45.34,14.7 46.13,14.7 46.35,14.47 v46.35,12.7 | C14.2 R15.2 44.96,18.8 v46.35,18.8
  Route2 0.254: v46.35,18.8 v46.35,12.7
  Route15 0.254: JP2.9 24.5,1.27 25.59,2.35 28.13,2.35 28.97,3.2 36.83,3.2 36.85,3.2 41.3,3.2 44.45,6.35 44.45,10.79 v46.35,12.7
  Bottom 0.254: JP2.9 24.4,2.17 CON1.P2
A4/SDA  (via drill 0.5)
  Top 0.254: IC1.27 27.81,10.85 27.81,9.97 27.5,9.65 26.35,9.65 25.78,9.08 25.78,7.62 26.42,6.99 32.64,6.99 33.4,6.22 v33.4,4.32
  Route2 0.254: JP1.12 42.55,20.32 40.65,20.32 38.92,18.59 37.01,18.59 34.92,16.51 34.92,5.14 35.37,4.7 35.37,4.06 34.86,3.56 34.04,3.56 33.4,4.19 v33.4,4.32
A5/SCL  (via drill 0.48)
  Top 0.254: IC1.28 28.32,9.78 27.69,9.14 26.67,9.14 26.29,8.76 26.29,7.87 26.67,7.49 32.89,7.49 33.91,6.48 33.91,5.02 v34.54,4.38
  Route2 0.254: v34.54,4.38 34.42,4.51 34.42,16.65 36.82,19.05 38.73,19.05 JP1.11
A6  (via drill 0.5)
  Top 0.254: IC1.19 25.02,13.97 v25.08,13.91 | R5.1 13.72,8.26 v13.72,7.24 R6.2
  Route2 0.254: 28,7.24 28,10.35 26.92,11.43 24.32,11.43 23.94,11.81 23.94,12.64 24.38,13.08 24.7,13.08 25.08,13.46 v25.08,13.91 | 28,7.24 28,2.6 26.67,1.27 JP2.8 | 28,7.24 21.46,7.24 19.3,9.4 17.02,9.4 15.88,8.26 R6.2 v13.72,7.24
A7  (via drill 0.5)
  Top 0.254: IC1.22 24.97,12.46 v24.77,12.26
  Route2 0.254: JP2.7 28.51,1.33 28.51,10.6 26.86,12.26 v24.77,12.26
AREF
  Top 0.254: JP2.14 10.79,1.78 11.56,2.54 17.14,2.54 17.59,2.98 19.49,2.98 20.07,3.56 21.84,3.56 22.61,4.32 22.61,7.24 23.11,7.75 23.11,10.16 23.94,10.99 23.94,12.64 24.38,13.08 25.4,13.08 25.78,13.46 IC1.20
  Top 0.305: C3.2 11.43,2.41 10.79,1.78
D0/RX  (via drill 0.5, 0.51)
  Top 0.203: 35.62,2.48 36.45,2.48 | 37.72,1.84 38.29,1.27 JP2.3
  Top 0.254: 35.62,2.48 29.78,2.48 v29.72,2.41 | IC1.30 v29.32,8.33 | 37.72,1.84 37.52,2.04 37.25,2.04 36.82,2.48 36.45,2.48 | R7.1 22.29,13.13 v22.29,14.22
  Route2 0.254: v29.72,2.41 29.32,2.81 v29.32,8.33 29.32,12.59 27.18,14.73 24.64,14.73 24.26,14.35 24.26,13.65 23.88,13.27 23.24,13.27 v22.29,14.22
D1/TX  (via drill 0.5)
  Top 0.254: JP2.2 40.45,1.27 39.24,2.48 37.83,2.48 34.47,5.84 34.42,6.73 32.13,9.02 30.42,9.02 v30.16,9.27 29.82,9.61 IC1.31 | U3.20 18.72,8.83 18.78,8.89 20.19,8.89 20.26,8.95 20.26,9.53 20.38,9.65 21.84,9.65 23.37,11.18 23.37,14.16 v23.43,14.22
  Route2 0.254: v23.43,14.22 23.43,14.54 24.19,15.3 27.3,15.3 29.9,12.71 29.9,10.03 30.16,9.77 v30.16,9.27
D2  (via drill 0.5)
  Top 0.254: v33.53,9.84 30.73,9.84 30.32,10.25 IC1.32
  Route2 0.254: JP1.6 28.57,21.34 27.81,20.57 27.81,19.94 29.72,18.03 29.72,17.4 32.89,14.22 32.89,13.21 33.49,12.62 33.49,10.34 33.47,10.32 33.47,9.91 v33.53,9.84
  Bottom 0.254: JP1.6 28.57,20.32 26.06,17.8 25.84,17.8 24.21,16.18 24.21,13.67 22.15,11.6 22.12,11.6 21.9,11.38 CON1.P7
D3  (via drill 0.5)
  Top 0.254: IC1.1 31.71,10.67 v32.7,10.67
  Route2 0.254: JP1.5 26.04,20.57 27.56,19.05 27.94,19.05 29.21,17.78 29.21,17.14 32.38,13.97 32.38,12.89 32.96,12.32 32.96,10.92 v32.7,10.67
  Bottom 0.254: JP1.5 22.95,18.5 22.66,18.5 20.49,16.33 20.49,13.07 21.42,12.14 21.42,9.01 CON1.P8
D4  (via drill 0.5)
  Top 0.254: IC1.2 32.05,11.96 32.05,11.79 v32.16,11.68
  Route2 0.254: JP1.4 24.26,21.59 27.3,18.54 27.69,18.54 28.7,17.53 28.7,16.89 31.88,13.72 31.88,11.96 v32.16,11.68
  Bottom 0.254: JP1.4 23.5,19.98 20.03,16.52 20.03,12.88 20.92,12 20.92,11.43 20.91,11.42 20.91,11.15 20.9,11.14 CON1.P9
D5
  Top 0.254: IC1.9 30.32,16.67 31.59,17.94 31.94,18.29 31.99,18.34 32.38,18.34 34.01,19.96 34.33,19.96 34.56,20.19 37.34,20.19 JP1.10
D6
  Top 0.254: IC1.10 29.82,16.93 31.69,18.8 32.19,18.8 32.7,19.3 32.7,19.94 33.19,20.42 34.14,20.42 34.48,20.77 34.73,20.77 35.37,20.77 JP1.9
D7  (via drill 0.5, 0.51)
  Top 0.254: IC1.11 29.32,17.2 31.75,19.62 v31.88,19.62 | JP2.1 43.05,1.27 41.78,2.54 39.83,2.54 39.43,2.93 38.02,2.93 34.92,6.03 34.92,18.39 v34.89,18.39
  Route2 0.254: v34.89,18.39 34.82,18.39 33.59,19.62 v31.88,19.62 | JP2.1 38.99,6.1 v36.96,6.1
  Route15 0.254: J1.1 11.43,15.24 10.16,13.97 10.16,12.7 12.7,10.16 30.48,10.16 34.54,6.1 v36.96,6.1
D9
  Top 0.254: IC1.13 28.32,16.13 28.7,16.51 28.7,17.34 30.67,19.3 30.67,19.56 31.56,20.45 32.19,20.45 33.34,21.59 JP1.8
D10
  Top 0.254: IC1.14 27.82,16.39 28.19,16.76 28.19,17.53 30.16,19.49 30.16,19.75 31.11,20.7 JP1.7
  Bottom 0.254: JP1.7 30.63,21.1 30.63,17.01 25.4,11.78 CON1.P0
D11/MOSI  (via drill 0.5)
  Top 0.254: IC1.15 27.32,17 v27.3,17.02
  Route2 0.254: v27.3,17.02 27.3,16.76 30.86,13.21 30.86,10.41 31.5,9.78 31.5,8.83 32.64,7.68 32.64,6.48 31.62,5.46 31.62,3.3 JP2.5
D12/MISO  (via drill 0.5)
  Top 0.254: IC1.16 26.42,15.97 26.42,16.38 26.16,16.64 v26.16,17.02
  Route2 0.254: v26.16,17.02 26.16,17.27 26.8,17.91 27.56,17.91 28.19,17.27 28.19,16.64 31.37,13.46 31.37,10.67 32,10.03 32,9.02 33.15,7.87 33.15,6.29 32.13,5.27 32.13,3.56 33.21,2.48 34.23,2.48 35.43,1.27 JP2.4
D13/SCK  (via drill 0.39, 0.5)
  Top 0.254: IC1.17 25.4,15.78 v25.4,16.13 | v5.71,19.81 5.54,19.99 5.08,19.99 | 5.08,19.99 4.47,19.99 | R8.1 5.08,19.99
  Route2 0.254: JP2.6 31.11,5.78 32.13,6.79 32.13,7.43 31.56,8 31.18,8 30.99,8.19 30.99,9.59 30.35,10.22 30.35,12.95 27.18,16.13 v25.4,16.13 25.15,16.38 25.15,17.14 26.29,18.29 26.29,18.8 25.65,19.43 22.23,19.43 21.78,18.99 16.57,18.99 15.37,17.78 7.75,17.78 v5.71,19.81
DTR
  Top 0.254: U3.23 17.22,8.84 18.29,9.91 19.24,9.91 20.26,10.92 C1.1
EN  (via drill 0.5, 0.51)
  Top 0.254: S1.2 41.8,8.37 v38.73,11.43 | v18.41,17.4 18.7,17.11 U2.3
  Route15 0.254: v38.73,11.43 32.94,17.23 30.56,17.23 27.97,19.82 20.19,19.82 JP1.2
  Route15 0.305: v18.41,17.4 JP1.2
GND  (via drill 0.39, 0.5, 0.51)
  Top 0.254: X1.SPRT@4 4.41,7.83 | IC1.5 28.57,13.46 IC1.TH | IC1.21 28.57,12.96 IC1.TH | IC1.3 28.57,12.46 28.57,12.57 | 28.57,12.57 IC1.TH | 28.57,12.57 28.32,12.57 v28.32,12.19 | U3.2 18.03,6.72 18.43,7.11 19.18,7.11 19.28,7.22 U3.18 | 33.08,11.44 32.96,11.56 | X1.GND 4.71,8.26 X1.SPRT@2 | U5.2 45.97,16.26 C13.2 | v41.66,18.29 40.61,18.29 40.26,18.64 39.52,18.64 U4.6 | R4.1 22.04,16 C2.1 | U1.2 17.04,11.62 17.23,11.43
  Top 0.305: 12.93,5.23 12.51,5.65 | 17.23,10.55 17.23,11.43 v17.23,12.75
  Route15 0.254: v41.66,18.29 41.91,18.54
  Bottom 0.254: v18.03,6.22 21.59,6.22 21.77,6.41 22.19,6.41 22.4,6.62 CON1.P6
  other vias: 1.78,11.43 10.92,8.38 4.19,0.89 6.73,16.13 13.91,16.83 9.46,12.19 17.34,16.51 9.53,1.97 22.2,20.6 29.84,20.7 33.63,14 33.63,8.64 9.65,5.4 36.2,7.62
  pour Top: 48.39,3.81 48.39,19.05 44.58,22.86 3.81,22.86 0,19.05 0,3.81 3.81,0 44.58,0
  pour Route2: 0,19.05 0,3.81 3.81,0 35.18,0 35.18,22.86 3.81,22.86
  pour Bottom: 3.81,22.86 44.58,22.86 48.39,19.05 48.39,3.81 44.58,0 3.81,0 0,3.81 0,19.05
  pour Route15: 3.81,22.86 44.58,22.86 48.39,19.05 48.39,3.81 44.58,0 3.81,0 0,3.81 0,19.05
N$1
  Top 0.254: D1.C 3.43,5.59 4.57,4.45 R2.1
N$2
  Top 0.203: 8.95,9.72 8.95,7.68
  Top 0.254: U3.3 15.37,6.22 15.18,6.41 13.34,6.41 12.26,7.49 9.14,7.49 8.95,7.68 | 8.95,9.72 8.78,9.88 7.42,9.88 5.88,11.43 X1.D+
N$3  (via drill 0.5)
  Top 0.254: v12.89,16.19 14.22,14.86 14.22,14.03 U1.1 | R2.2 6.1,4.89 v6.67,5.46
  Route2 0.254: v12.89,16.19 10.02,16.19 6.35,12.53 6.35,5.77 v6.67,5.46
N$4
  Top 0.254: U1.5 20.48,14.48 R4.2
N$5
  Top 0.254: D3.A 3.49,17.34 4.45,18.29 R8.2
N$6  (via drill 0.5)
  Top 0.254: v9.53,6.6 9.91,6.99 12.06,6.99 13.14,5.91 14.99,5.91 15.17,5.72 U3.4 | X1.D- 6.09,12.08 7.5,10.67 v7.75,10.67
  Route2 0.254: v7.75,10.67 7.75,8.38 v9.53,6.6
N$7  (via drill 0.5)
  Top 0.254: U2.1 18.79,14.25 19.31,14.25 20.03,14.97 C4.1
  Top 0.406: v12.06,13.55 12.04,13.53 D2.K | v14.35,12.7 Q1.2 | v17.36,13.97 17.55,14.16 U2.1
  Route2 0.406: v12.06,13.55 13.5,13.55 v14.35,12.7 15.24,13.59 16.85,13.59 16.87,13.61 16.99,13.61 v17.36,13.97
N$8
  Top 0.254: D5.A 30.23,4.38 R10.1
N$9
  Top 0.254: D4.A 30.54,6.03 R9.1
N$10
  Top 0.254: U3.5 U3.6
  Top 0.305: U3.6 15.95,4.7 C10.1
N$12
  Top 0.254: R11.1 J2.1
N$16
  Top 0.254: U4.1 37.47,17.93 C12.1
N$17
  Top 0.254: U5.4 43.05,18.12 R15.1 C14.1 42.93,19.43 R12.2
N$29
  Top 0.254: R12.1 C12.2
N$30
  Top 0.254: R14.2 R13.1 42.93,14.76 43.06,14.89 43.06,15.93 44,16.86 44.39,16.86 U5.3 45.05,17.53 C13.1
N$41
  Top 0.254: U3.16 20.95,6.22 21.53,6.79 C11.1
RESET  (via drill 0.5)
  Top 0.254: JP2.16 5.84,1.27 7.62,3.05 8.15,3.05 | IC1.29 28.82,9.14 28.19,8.51 27.69,8.51 27.5,8.32 v27.18,8.32 | 8.15,3.05 9.46,3.05 v9.53,3.11 | SW1.B' 8.15,7.09 8.7,6.54 8.7,5.14 8.15,4.6 SW1.B 8.15,3.05 | C1.2 20.45,12.57 v21.27,13.4 | R3.1 24.38,18.54 v25.4,18.54
  Route2 0.254: v9.53,3.11 9.53,3.68 10.54,4.7 10.54,6.86 8.83,8.57 8.83,10.79 11.18,10.79 11.94,10.03 12.89,10.03 14.1,11.24 16.83,11.24 18.1,12.51 19.56,12.51 | v25.4,18.54 24.26,17.4 24.26,16.38 23.75,15.88 22.1,15.88 21.27,15.05 v21.27,13.4 20.45,13.4 19.56,12.51 | v27.18,8.32 21.4,8.32 19.81,9.91 19.81,12.19 19.56,12.45 19.56,12.51
RXD
  Top 0.254: U3.21 18.22,9.14 18.48,9.4 19.43,9.4 20.19,10.16 21.53,10.16 22.33,10.96 R7.2
RXLED  (via drill 0.5)
  Top 0.254: U3.13 20.31,4.38 v21.02,4.38 | D5.C 25.68,4.38 v25.49,4.57
  Route2 0.254: v21.02,4.38 25.3,4.38 v25.49,4.57
TXLED  (via drill 0.5)
  Top 0.254: U3.14 21.73,5.22 v21.78,5.27 | D4.C 25.62,6.03 v25.49,5.91
  Route2 0.254: v25.49,5.91 25.11,5.52 22.04,5.52 v21.78,5.27
VBAT
  Top 0.254: Q1.3 13.4,10.22 R5.2 13.75,10.57 15.88,10.57 U1.3
  Top 0.406: Q1.3 11.05,15.8 11.05,16.89 12.83,18.67 C7.1 15.49,21.21 JP1.1
  Bottom 0.254: CON1.P11 19.8,8.89
  Bottom 0.406: JP1.1 15.88,16.51 14.89,15.52 14.89,14.5 15.88,13.52 15.88,11.43 18.41,8.89 19.8,8.89
VBUS  (via drill 0.5)
  Top 0.254: v25.53,3.17 29.21,3.17 29.88,3.84 30.95,3.84 31.68,4.57 R10.2 R9.2 | U3.8 17.22,3.3 16.97,3.05 15.68,3.05 15.23,3.5 v14.8,3.5 | D1.A 1.16,5.83 0.5,6.49 0.5,12.71 0.8,13.01 3.27,13.01 3.63,12.65 4.24,12.65 4.32,12.73 X1.VBUS | C6.2 7.87,13.91 7.87,14.16 | 9.79,9.84 9.72,9.91 | v10.6,9.84 10.67,9.91
  Top 0.305: U3.7 U3.8
  Top 0.381: X1.VBUS 6.19,12.73
  Top 0.406: U1.4 18.67,10.77 v18.67,11.63 | 6.6,12.32 6.19,12.73 6.5,12.73 | 6.6,12.32 6.73,12.19 | D2.A 8.97,13.84 C6.2 6.7,12.73 6.5,12.73 | 6.5,12.73 6.6,12.83 6.6,12.32 | 6.73,12.96 6.73,12.19 | 6.73,12.19 7.39,11.53 8.1,11.53 9.72,9.91 10.67,9.91 10.92,10.16 R1.2 12.45,10.42 Q1.1
  Top 0.508: 7.87,14.16 7.87,18.57 8.76,19.46
  Top 0.61: 8.76,19.46 v8.76,19.68
  Route2 0.254: v25.53,3.17 16.4,3.17 16.07,3.5 v14.8,3.5
  Route2 0.406: v14.8,3.5 14.59,3.5 12.06,6.03 12.06,9.34 | 12.06,9.34 11.11,9.34 v10.6,9.84 | 12.06,9.34 13.08,9.34 14.41,10.67 18.1,10.67 18.67,11.24 v18.67,11.63
  Route2 0.61: JP1.3 20.32,21.59 18.92,20.19 9.27,20.19 v8.76,19.68
XTAL1
  Top 0.254: IC1.8 31.11,15.15 31.11,16.38 31.71,16.98 Y1.3
XTAL2
  Top 0.254: IC1.7 31.48,14.46 32,14.98 Y1.1
(copper drawn outside any net)
  shapes: Top area x1

### Text on the board
tPlace: BAT | EN | USB | 4 | 3 | 2 | 9 | 6 | 10 | #13 | reset | RX | 7 | CHG | TX | MOSI | MISO | RST | 3V | AR | GND | A0 | A1 | A2 | A3 | A6 | A7 | SCK | RX | TX
bPlace: ~ | 1S LiPo Batt / µUSB charge | BAT | En | USB | 4 | 3~ | 2 | 10~ | 9~ | 6~ | 5 | SCL | SDA | NU Smarticle / Feather 328p / ATmega328p | 8MHz/3.3V | RST | 3V | Aref | GND | A0 | A1 | A2 | A3 | A6 | A7 | SCK | MOSI | MISO | RX | TX | 7